# Altium schematic sheet eMMC.SchDoc
size A4; SheetNumber: 6; SheetTotal: 6
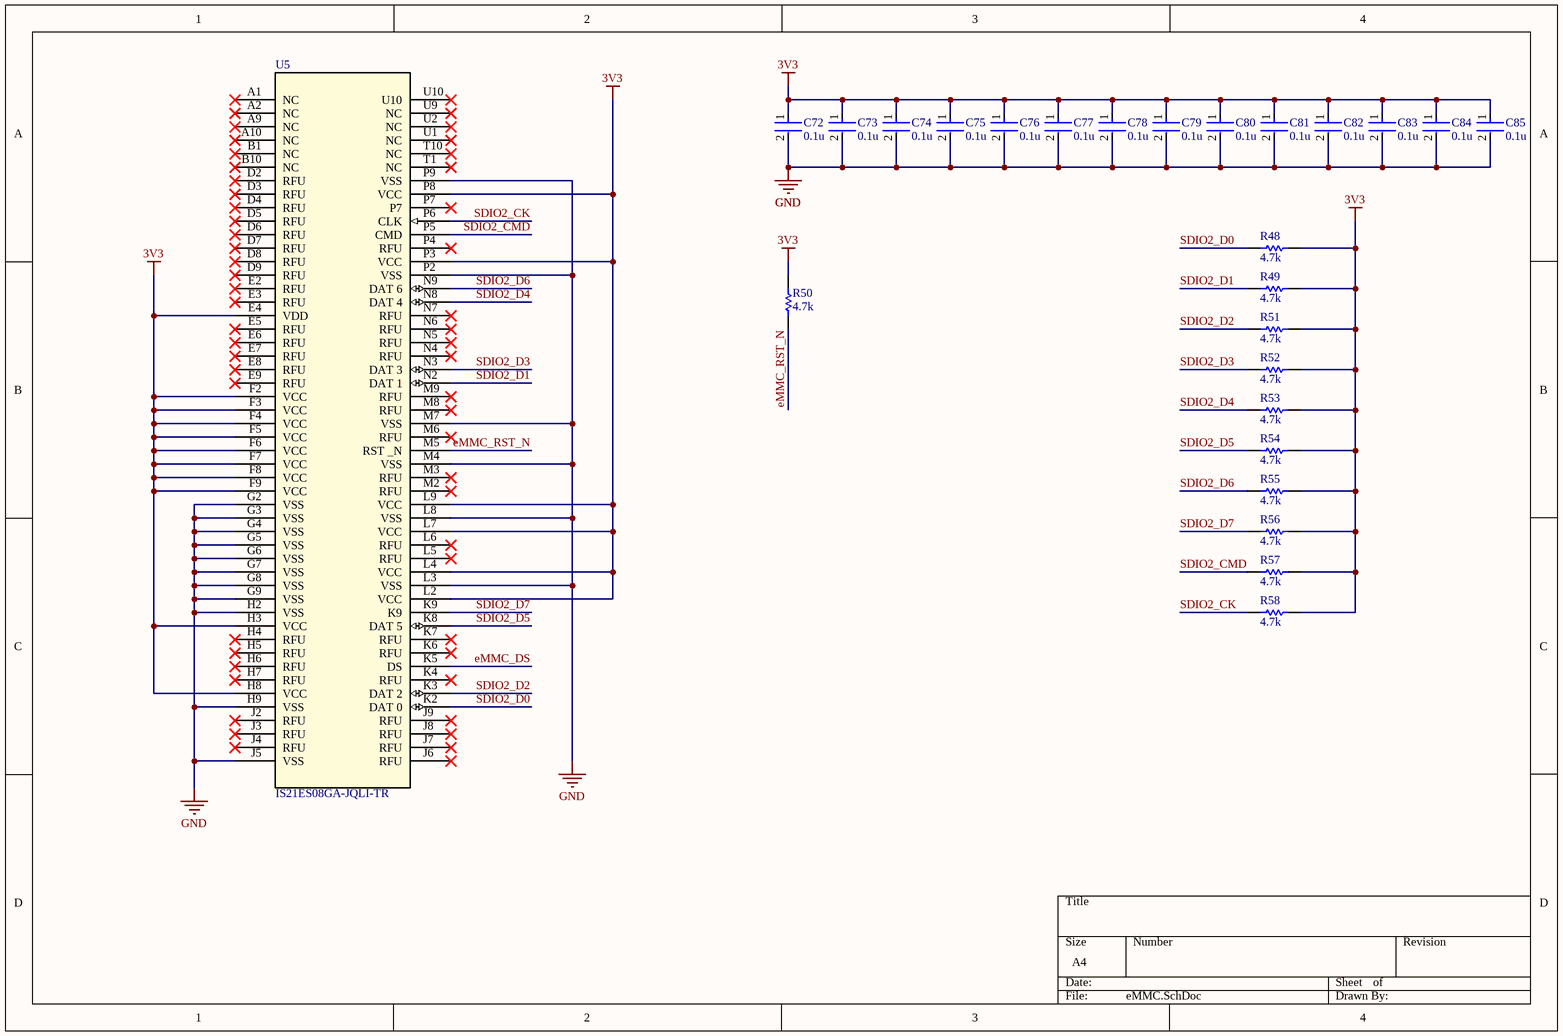
[diagram p0: eMMC.SchDoc]

## Parts
C72  0.1u  [FP-C0603C-CF-MFG]
C73  0.1u  [FP-C0603C-CF-MFG]
C74  0.1u  [FP-C0603C-CF-MFG]
C75  0.1u  [FP-C0603C-CF-MFG]
C76  0.1u  [FP-C0603C-CF-MFG]
C77  0.1u  [FP-C0603C-CF-MFG]
C78  0.1u  [FP-C0603C-CF-MFG]
C79  0.1u  [FP-C0603C-CF-MFG]
C80  0.1u  [FP-C0603C-CF-MFG]
C81  0.1u  [FP-C0603C-CF-MFG]
C82  0.1u  [FP-C0603C-CF-MFG]
C83  0.1u  [FP-C0603C-CF-MFG]
C84  0.1u  [FP-C0603C-CF-MFG]
C85  0.1u  [FP-C0603C-CF-MFG]
R48  4.7k  [RESC1609X50X30NL8T20]
R49  4.7k  [RESC1609X50X30NL8T20]
R50  4.7k  [RESC1609X50X30NL8T20]
R51  4.7k  [RESC1609X50X30NL8T20]
R52  4.7k  [RESC1609X50X30NL8T20]
R53  4.7k  [RESC1609X50X30NL8T20]
R54  4.7k  [RESC1609X50X30NL8T20]
R55  4.7k  [RESC1609X50X30NL8T20]
R56  4.7k  [RESC1609X50X30NL8T20]
R57  4.7k  [RESC1609X50X30NL8T20]
R58  4.7k  [RESC1609X50X30NL8T20]
U5  IS21ES08GA-JQLI-TR  [FBGA100_ISI]

## Nets
3V3: C72.1 C73.1 C74.1 C75.1 C76.1 C77.1 C78.1 C79.1 C80.1 C81.1 C82.1 C83.1 C84.1 C85.1 R48.1 R49.1 R50.2 R51.1 R52.1 R53.1 R54.1 R55.1 R56.1 R57.1 R58.1 U5.E4(VDD) U5.F2(VCC) U5.F3(VCC) U5.F4(VCC) U5.F5(VCC) U5.F6(VCC) U5.F7(VCC) U5.F8(VCC) U5.F9(VCC) U5.H3(VCC) U5.H8(VCC) U5.L2(VCC) U5.L4(VCC) U5.L7(VCC) U5.L9(VCC) U5.P3(VCC) U5.P8(VCC)
GND: C72.2 C73.2 C74.2 C75.2 C76.2 C77.2 C78.2 C79.2 C80.2 C81.2 C82.2 C83.2 C84.2 C85.2 U5.G2(VSS) U5.G3(VSS) U5.G4(VSS) U5.G5(VSS) U5.G6(VSS) U5.G7(VSS) U5.G8(VSS) U5.G9(VSS) U5.H2(VSS) U5.H9(VSS) U5.J5(VSS) U5.L3(VSS) U5.L8(VSS) U5.M4(VSS) U5.M7(VSS) U5.P2(VSS) U5.P9(VSS)
eMMC_DS: U5.K5(DS)
eMMC_RST_N: R50.1 U5.M5(RST__N)
SDIO2_CK: R58.2 U5.P6(CLK)
SDIO2_CMD: R57.2 U5.P5(CMD)
SDIO2_D0: R48.2 U5.K2(DAT_0)
SDIO2_D1: R49.2 U5.N2(DAT_1)
SDIO2_D2: R51.2 U5.K3(DAT_2)
SDIO2_D3: R52.2 U5.N3(DAT_3)
SDIO2_D4: R53.2 U5.N8(DAT_4)
SDIO2_D5: R54.2 U5.K8(DAT_5)
SDIO2_D6: R55.2 U5.N9(DAT_6)
SDIO2_D7: R56.2 U5.K9

Not connected (* = marked no-connect by the designer): U5 A1(NC)* A2(NC)* A9(NC)* A10(NC)* B1(NC)* B10(NC)* D2(RFU)* D3(RFU)* D4(RFU)* D5(RFU)* D6(RFU)* D7(RFU)* D8(RFU)* D9(RFU)* E2(RFU)* E3(RFU)* E5(RFU)* E6(RFU)* E7(RFU)* E8(RFU)* E9(RFU)* H4(RFU)* H5(RFU)* H6(RFU)* H7(RFU)* J2(RFU)* J3(RFU)* J4(RFU)* J6(RFU)* J7(RFU)* J8(RFU)* J9(RFU)* K4(RFU)* K6(RFU)* K7(RFU)* L5(RFU)* L6(RFU)* M2(RFU)* M3(RFU)* M6(RFU)* M8(RFU)* M9(RFU)* N4(RFU)* N5(RFU)* N6(RFU)* N7(RFU)* P4(RFU)* P7* T1(NC)* T10(NC)* U1(NC)* U2(NC)* U9(NC)* U10*

## Library data of the parts
C72-C85 = CMP-2006-03061-2: CAP CER 0.1UF 50V X7R 0603; Manufacturer: KEMET; Manufacturer Part Number: C0603C104K5RACTU; Tolerance: 0.1; Temperature Coefficient: 30ppm/°C; Material: Ceramic; Automotive Grade: Grade 1; Value: 0.10 μF; Temperature: -55°C to +125°C; RoHS: TRUE; Temperature Range High: +125°C; Lead Free: Yes; Octopart: https://octopart.com/c0603c104k5ractu-kemet-139244; Digikey Description: CAP CER 0.1UF 50V X7R 0603; Category: Cap; Package: C0603C-CF; ComponentLink2Description: Datasheet; Temperature Range Low: -55°C; Device Class L1: Passive Components; Voltage Rating: 50 V; Automotive: Yes; Device Class L3: Ceramic Capacitors; ComponentLink2URL: https://api.kemet.com/component-edge/download/datasheet/C0603C100J5GACAUTO.pdf; Capacitance: 0.10 μF; Device Class L2: Capacitors; Temperature Characteristic: X7R; Height: 0.87mm
R48-R58 = CMP-1666-00005-4: Chip Resistor, 10 KOhm, +/- 1%, 100 mW, -55 to 155 degC, 0603 (1608 Metric), RoHS, Tape and Reel; Manufacturer: Vishay Semiconductor; Voltage Rating: 75 V; Max Operating Temperature: 155 degC; PackageDescription: 2-Pin Surface Mount Device, Body 1.575 x 0.85 mm; ComponentLink1Description: Manufacturer URL; RoHSCompliant: true; PackageReference: 0603; REACH SVHC: Unknown; Length: 1.55 mm; DatasheetVersion: 06/2012; Packaging: Tape and Reel; Min Operating Temperature: -55 degC; Mounting Technology: Surface Mount; ComponentLink2URL: https://datasheet.ciiva.com/11809/0900766b80d98afc-11809037.pdf; Height: 0.45 mm; ComponentLink2Description: Datasheet; Package Quantity: 5000; ComponentLink1URL: http://www.vishay.com/
U5 = IS21ES08GA-JQLI-TR: No Description Available; Mfr_Name: ISSI; Type: Memory; RefDes: RefDes